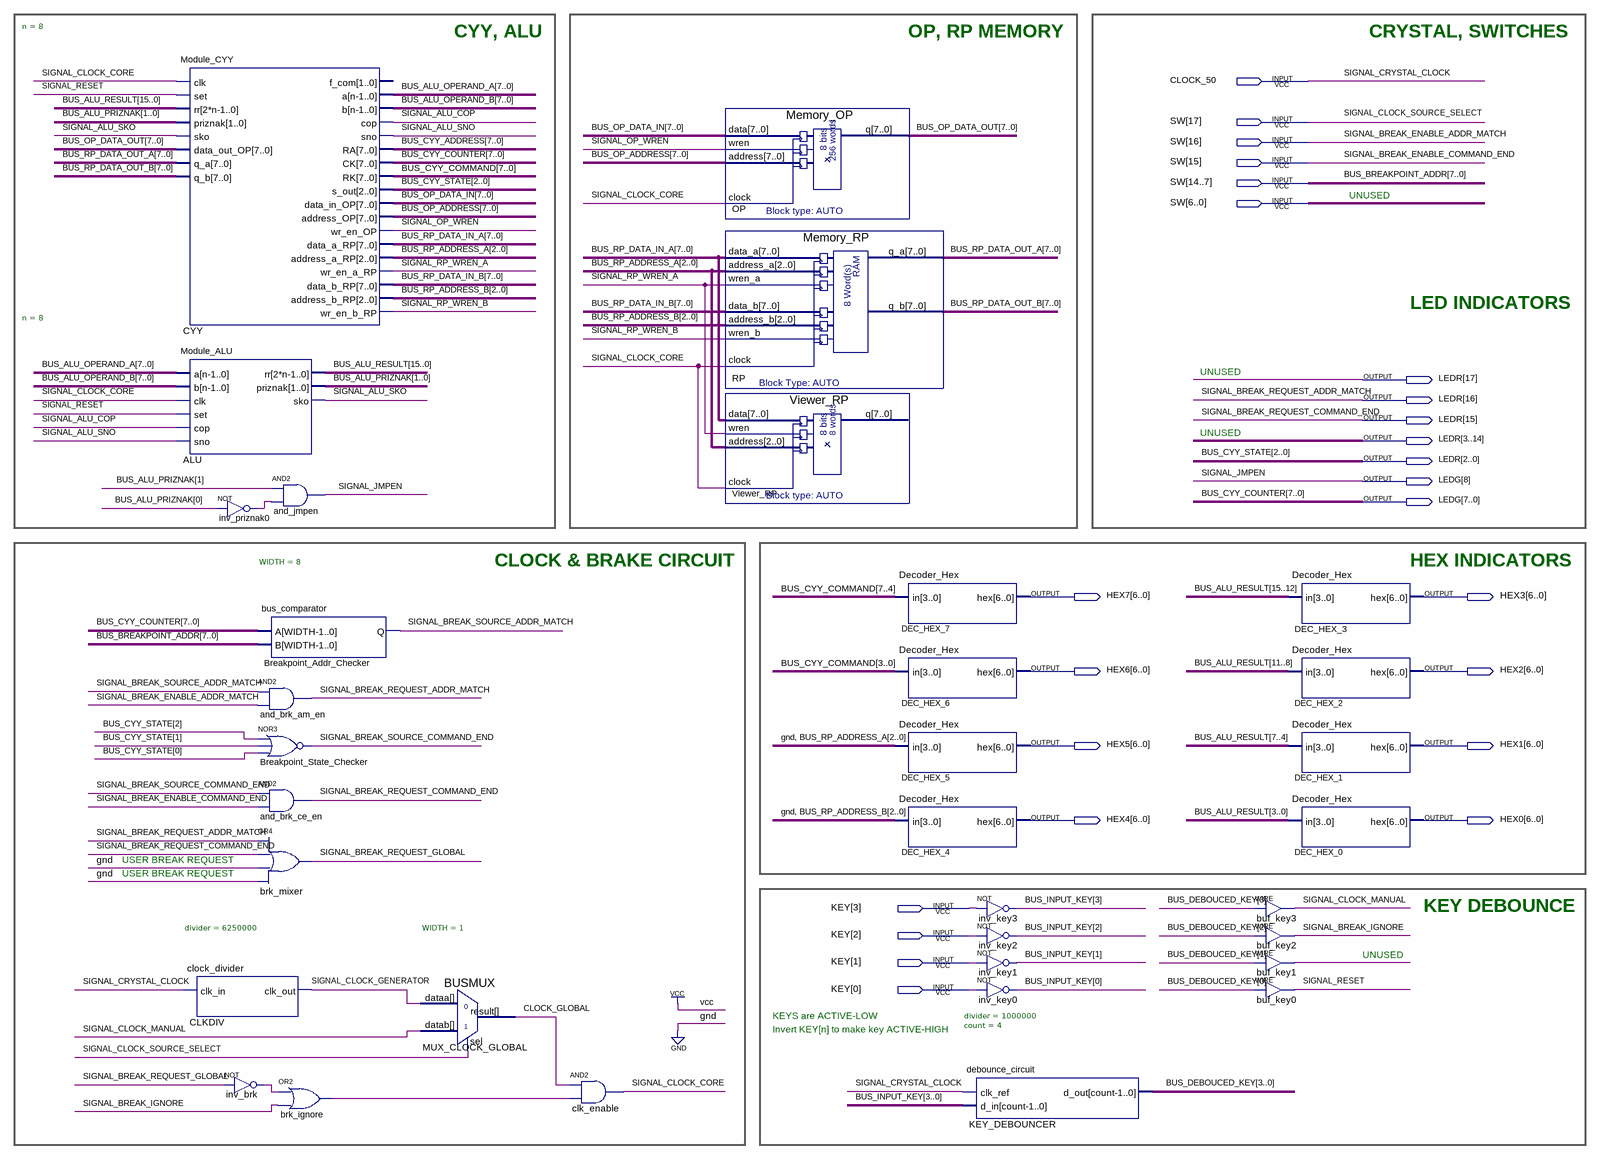
[diagram p0: schematic sheet]
// Quartus schematic K3_Edu_CISC.bdf as structural Verilog: 34 symbols, 25 pins
module K3_Edu_CISC (
  input  CLOCK_50,
  input  [17:0] SW,
  input  [3:0] KEY,
  output [0:17] LEDR,
  output [8:0] LEDG,
  output [6:0] HEX7,
  output [6:0] HEX3,
  output [6:0] HEX6,
  output [6:0] HEX2,
  output [6:0] HEX5,
  output [6:0] HEX1,
  output [6:0] HEX4,
  output [6:0] HEX0
);

  wire brk_ignore_out, buf_key1_out, CLOCK_GLOBAL, inv_brk_out, inv_priznak0_out, SIGNAL_ALU_COP,
       SIGNAL_ALU_SKO, SIGNAL_ALU_SNO, SIGNAL_BREAK_IGNORE, SIGNAL_BREAK_REQUEST_GLOBAL,
       SIGNAL_BREAK_SOURCE_ADDR_MATCH, SIGNAL_BREAK_SOURCE_COMMAND_END, SIGNAL_CLOCK_CORE,
       SIGNAL_CLOCK_GENERATOR, SIGNAL_CLOCK_MANUAL, SIGNAL_OP_WREN, SIGNAL_RESET, SIGNAL_RP_WREN_A,
       SIGNAL_RP_WREN_B;
  wire [1:0] BUS_ALU_PRIZNAK;
  wire [2:0] BUS_RP_ADDRESS_A, BUS_RP_ADDRESS_B;
  wire [3:0] BUS_DEBOUCED_KEY, BUS_INPUT_KEY;
  wire [7:0] BUS_ALU_OPERAND_A, BUS_ALU_OPERAND_B, BUS_CYY_ADDRESS, BUS_CYY_COMMAND, BUS_OP_ADDRESS,
       BUS_OP_DATA_IN, BUS_OP_DATA_OUT, BUS_RP_DATA_IN_A, BUS_RP_DATA_IN_B, BUS_RP_DATA_OUT_A,
       BUS_RP_DATA_OUT_B;
  wire [15:0] BUS_ALU_RESULT;

  Module_CYY #(.n(8)) CYY (
    .clk(SIGNAL_CLOCK_CORE), .set(SIGNAL_RESET), .rr(BUS_ALU_RESULT), .priznak(BUS_ALU_PRIZNAK),
    .sko(SIGNAL_ALU_SKO), .data_out_OP(BUS_OP_DATA_OUT), .q_a(BUS_RP_DATA_OUT_A), .q_b(BUS_RP_DATA_OUT_B),
    .a(BUS_ALU_OPERAND_A), .b(BUS_ALU_OPERAND_B), .cop(SIGNAL_ALU_COP), .sno(SIGNAL_ALU_SNO),
    .RA(BUS_CYY_ADDRESS), .CK(LEDG[7:0]), .RK(BUS_CYY_COMMAND), .s_out({LEDR[2], LEDR[1], LEDR[0]}),
    .data_in_OP(BUS_OP_DATA_IN), .address_OP(BUS_OP_ADDRESS), .wr_en_OP(SIGNAL_OP_WREN),
    .data_a_RP(BUS_RP_DATA_IN_A), .address_a_RP(BUS_RP_ADDRESS_A), .wr_en_a_RP(SIGNAL_RP_WREN_A),
    .data_b_RP(BUS_RP_DATA_IN_B), .address_b_RP(BUS_RP_ADDRESS_B), .wr_en_b_RP(SIGNAL_RP_WREN_B));  // open: f_com
  Module_ALU #(.n(8)) ALU (
    .a(BUS_ALU_OPERAND_A), .b(BUS_ALU_OPERAND_B), .clk(SIGNAL_CLOCK_CORE), .set(SIGNAL_RESET),
    .cop(SIGNAL_ALU_COP), .sno(SIGNAL_ALU_SNO), .rr(BUS_ALU_RESULT), .priznak(BUS_ALU_PRIZNAK),
    .sko(SIGNAL_ALU_SKO));
  not inv_priznak0 (inv_priznak0_out, BUS_ALU_PRIZNAK[0]);
  clock_divider #(.divider(6250000)) CLKDIV (.clk_in(CLOCK_50), .clk_out(SIGNAL_CLOCK_GENERATOR));
  not inv_brk (inv_brk_out, SIGNAL_BREAK_REQUEST_GLOBAL);
  and and_jmpen (LEDG[8], BUS_ALU_PRIZNAK[1], inv_priznak0_out);
  bus_comparator #(.WIDTH(8)) Breakpoint_Addr_Checker (.A(LEDG[7:0]), .B(SW[14:7]), .Q(SIGNAL_BREAK_SOURCE_ADDR_MATCH));
  and and_brk_am_en (LEDR[16], SIGNAL_BREAK_SOURCE_ADDR_MATCH, SW[16]);
  nor Breakpoint_State_Checker (SIGNAL_BREAK_SOURCE_COMMAND_END, LEDR[2], LEDR[1], LEDR[0]);
  and and_brk_ce_en (LEDR[15], SIGNAL_BREAK_SOURCE_COMMAND_END, SW[15]);
  or brk_mixer (SIGNAL_BREAK_REQUEST_GLOBAL, LEDR[16], LEDR[15], 1'b0, 1'b0);
  or brk_ignore (brk_ignore_out, inv_brk_out, SIGNAL_BREAK_IGNORE);
  BUSMUX #(.WIDTH(1)) MUX_CLOCK_GLOBAL (
    .datab(SIGNAL_CLOCK_MANUAL), .sel(SW[17]), .dataa(SIGNAL_CLOCK_GENERATOR), .result(CLOCK_GLOBAL));
  and clk_enable (SIGNAL_CLOCK_CORE, CLOCK_GLOBAL, brk_ignore_out);
  Memory_OP OP (
    .data(BUS_OP_DATA_IN), .wren(SIGNAL_OP_WREN), .address(BUS_OP_ADDRESS), .clock(SIGNAL_CLOCK_CORE),
    .q(BUS_OP_DATA_OUT));
  Memory_RP RP (
    .data_a(BUS_RP_DATA_IN_A), .address_a(BUS_RP_ADDRESS_A), .wren_a(SIGNAL_RP_WREN_A),
    .data_b(BUS_RP_DATA_IN_B), .address_b(BUS_RP_ADDRESS_B), .wren_b(SIGNAL_RP_WREN_B),
    .clock(SIGNAL_CLOCK_CORE), .q_a(BUS_RP_DATA_OUT_A), .q_b(BUS_RP_DATA_OUT_B));
  Viewer_RP Viewer_RP (
    .data(BUS_RP_DATA_IN_A), .wren(SIGNAL_RP_WREN_A), .address(BUS_RP_ADDRESS_A), .clock(SIGNAL_CLOCK_CORE));  // open: q
  Decoder_Hex DEC_HEX_7 (.in(BUS_CYY_COMMAND[7:4]), .hex(HEX7));
  Decoder_Hex DEC_HEX_6 (.in(BUS_CYY_COMMAND[3:0]), .hex(HEX6));
  Decoder_Hex DEC_HEX_5 (.in({1'b0, BUS_RP_ADDRESS_A}), .hex(HEX5));
  Decoder_Hex DEC_HEX_4 (.in({1'b0, BUS_RP_ADDRESS_B}), .hex(HEX4));
  not inv_key3 (BUS_INPUT_KEY[3], KEY[3]);
  not inv_key2 (BUS_INPUT_KEY[2], KEY[2]);
  not inv_key1 (BUS_INPUT_KEY[1], KEY[1]);
  not inv_key0 (BUS_INPUT_KEY[0], KEY[0]);
  debounce_circuit #(.divider(1000000), .count(4)) KEY_DEBOUNCER (
    .clk_ref(CLOCK_50), .d_in(BUS_INPUT_KEY), .d_out(BUS_DEBOUCED_KEY));
  assign SIGNAL_CLOCK_MANUAL = BUS_DEBOUCED_KEY[3];  // WIRE buf_key3
  assign SIGNAL_BREAK_IGNORE = BUS_DEBOUCED_KEY[2];  // WIRE buf_key2
  assign buf_key1_out = BUS_DEBOUCED_KEY[1];  // WIRE buf_key1
  assign SIGNAL_RESET = BUS_DEBOUCED_KEY[0];  // WIRE buf_key0
  Decoder_Hex DEC_HEX_3 (.in(BUS_ALU_RESULT[15:12]), .hex(HEX3));
  Decoder_Hex DEC_HEX_2 (.in(BUS_ALU_RESULT[11:8]), .hex(HEX2));
  Decoder_Hex DEC_HEX_1 (.in(BUS_ALU_RESULT[7:4]), .hex(HEX1));
  Decoder_Hex DEC_HEX_0 (.in(BUS_ALU_RESULT[3:0]), .hex(HEX0));

  // Other names for the same wires on the sheet: BUS_BREAKPOINT_ADDR[7:0] = SW[14:7];
  //   BUS_CYY_COUNTER[7:0] = LEDG[7:0]; BUS_CYY_STATE[2:0] = {LEDR[2], LEDR[1], LEDR[0]};
  //   SIGNAL_BREAK_ENABLE_ADDR_MATCH = SW[16]; SIGNAL_BREAK_ENABLE_COMMAND_END = SW[15];
  //   SIGNAL_BREAK_REQUEST_ADDR_MATCH = LEDR[16]; SIGNAL_BREAK_REQUEST_COMMAND_END = LEDR[15];
  //   SIGNAL_CLOCK_SOURCE_SELECT = SW[17]; SIGNAL_CRYSTAL_CLOCK = CLOCK_50; SIGNAL_JMPEN = LEDG[8]

  // Notes on the sheet:
  //   CYY, ALU
  //   OP, RP MEMORY
  //   CRYSTAL, SWITCHES
  //   UNUSED
  //   LED INDICATORS
  //   UNUSED
  //   UNUSED
  //   CLOCK & BRAKE CIRCUIT
  //   HEX INDICATORS
  //   USER BREAK REQUEST
  //   USER BREAK REQUEST
  //   KEY DEBOUNCE
  //   UNUSED
  //   KEYS are ACTIVE-LOW
  //   Invert KEY[n] to make key ACTIVE-HIGH
endmodule
